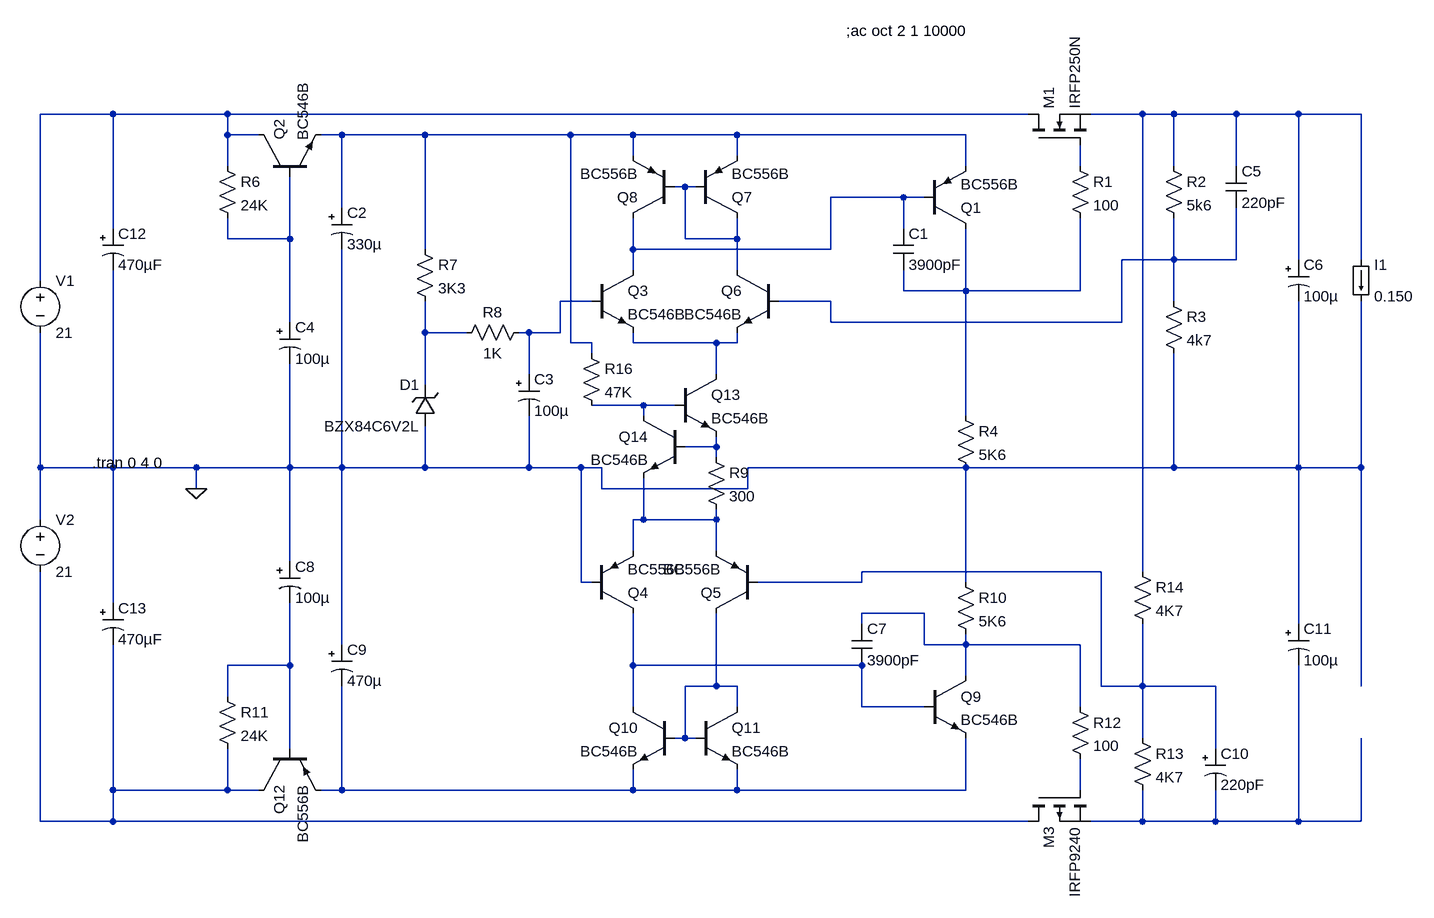
[diagram p0: schematic Draft3.asc]
Draft3.asc, the LTspice schematic file:
Version 4
SHEET 1 1752 1332
WIRE -272 112 -384 112
WIRE -96 112 -272 112
WIRE 1136 112 -96 112
WIRE 1312 112 1232 112
WIRE 1360 112 1312 112
WIRE 1456 112 1360 112
WIRE 1552 112 1456 112
WIRE 1648 112 1552 112
WIRE -96 144 -96 112
WIRE -48 144 -96 144
WIRE 80 144 48 144
WIRE 208 144 80 144
WIRE 432 144 208 144
WIRE 528 144 432 144
WIRE 688 144 528 144
WIRE 1040 144 688 144
WIRE 528 176 528 144
WIRE 688 176 688 144
WIRE -96 192 -96 144
WIRE 1040 192 1040 144
WIRE 1216 192 1216 160
WIRE 1360 192 1360 112
WIRE 1456 192 1456 112
WIRE 608 224 592 224
WIRE 624 224 608 224
WIRE 944 240 832 240
WIRE 976 240 944 240
WIRE 80 256 80 144
WIRE -272 288 -272 112
WIRE 944 288 944 240
WIRE -96 304 -96 272
WIRE 0 304 0 208
WIRE 0 304 -96 304
WIRE 608 304 608 224
WIRE 688 304 688 272
WIRE 688 304 608 304
WIRE 208 320 208 144
WIRE 528 320 528 272
WIRE 832 320 832 240
WIRE 832 320 528 320
WIRE 1360 336 1360 272
WIRE 1360 336 1280 336
WIRE 1456 336 1456 256
WIRE 1456 336 1360 336
WIRE 1552 336 1552 112
WIRE 1648 336 1648 112
WIRE 528 352 528 320
WIRE 688 352 688 304
WIRE -384 368 -384 112
WIRE 944 384 944 352
WIRE 1040 384 1040 288
WIRE 1040 384 944 384
WIRE 1216 384 1216 272
WIRE 1216 384 1040 384
WIRE 464 400 416 400
WIRE 832 400 752 400
WIRE 1360 400 1360 336
WIRE 0 432 0 304
WIRE 832 432 832 400
WIRE 1280 432 1280 336
WIRE 1280 432 832 432
WIRE 208 448 208 400
WIRE 272 448 208 448
WIRE 368 448 352 448
WIRE 416 448 416 400
WIRE 416 448 368 448
WIRE 432 464 432 144
WIRE 464 464 432 464
WIRE 528 464 528 448
WIRE 656 464 528 464
WIRE 688 464 688 448
WIRE 688 464 656 464
WIRE 464 480 464 464
WIRE 368 512 368 448
WIRE 656 512 656 464
WIRE 208 528 208 448
WIRE 544 560 464 560
WIRE 592 560 544 560
WIRE 544 576 544 560
WIRE 1040 576 1040 384
WIRE 656 624 656 608
WIRE 656 624 608 624
WIRE 656 640 656 624
WIRE -384 656 -384 448
WIRE -272 656 -272 352
WIRE -272 656 -384 656
WIRE -144 656 -272 656
WIRE 0 656 0 496
WIRE 0 656 -144 656
WIRE 80 656 80 320
WIRE 80 656 0 656
WIRE 208 656 208 592
WIRE 208 656 80 656
WIRE 368 656 368 576
WIRE 368 656 208 656
WIRE 448 656 368 656
WIRE 480 656 448 656
WIRE 1040 656 704 656
WIRE 1360 656 1360 480
WIRE 1360 656 1040 656
WIRE 1552 656 1552 400
WIRE 1552 656 1360 656
WIRE 1648 656 1648 400
WIRE 1648 656 1552 656
WIRE -144 688 -144 656
WIRE 480 688 480 656
WIRE 704 688 704 656
WIRE 704 688 480 688
WIRE -384 736 -384 656
WIRE 544 736 544 672
WIRE 544 736 528 736
WIRE 656 736 656 720
WIRE 656 736 544 736
WIRE 528 784 528 736
WIRE 656 784 656 736
WIRE 0 800 0 656
WIRE 1248 816 880 816
WIRE 1312 816 1312 112
WIRE 448 832 448 656
WIRE 464 832 448 832
WIRE 880 832 880 816
WIRE 880 832 720 832
WIRE 1040 832 1040 656
WIRE -272 864 -272 656
WIRE 976 880 880 880
WIRE 880 896 880 880
WIRE 1552 896 1552 656
WIRE 80 928 80 656
WIRE 976 928 976 880
WIRE 1040 928 1040 912
WIRE 1040 928 976 928
WIRE 1216 928 1040 928
WIRE 0 960 0 864
WIRE 0 960 -96 960
WIRE 528 960 528 880
WIRE 880 960 528 960
WIRE 1040 976 1040 928
WIRE 656 992 656 880
WIRE 656 992 608 992
WIRE 688 992 656 992
WIRE 1248 992 1248 816
WIRE 1312 992 1312 896
WIRE 1312 992 1248 992
WIRE 1424 992 1312 992
WIRE 1648 992 1648 656
WIRE -96 1008 -96 960
WIRE 528 1024 528 960
WIRE 688 1024 688 992
WIRE 880 1024 880 960
WIRE 976 1024 880 1024
WIRE 1216 1024 1216 928
WIRE 608 1072 608 992
WIRE 608 1072 592 1072
WIRE 624 1072 608 1072
WIRE 1312 1072 1312 992
WIRE 0 1088 0 960
WIRE 1424 1088 1424 992
WIRE -272 1152 -272 928
WIRE -96 1152 -96 1088
WIRE -96 1152 -272 1152
WIRE -48 1152 -96 1152
WIRE 80 1152 80 992
WIRE 80 1152 48 1152
WIRE 528 1152 528 1120
WIRE 528 1152 80 1152
WIRE 688 1152 688 1120
WIRE 688 1152 528 1152
WIRE 1040 1152 1040 1072
WIRE 1040 1152 688 1152
WIRE 1216 1152 1216 1104
WIRE -384 1200 -384 816
WIRE -272 1200 -272 1152
WIRE -272 1200 -384 1200
WIRE 1136 1200 -272 1200
WIRE 1312 1200 1312 1152
WIRE 1312 1200 1232 1200
WIRE 1424 1200 1424 1152
WIRE 1424 1200 1312 1200
WIRE 1552 1200 1552 960
WIRE 1552 1200 1424 1200
WIRE 1648 1200 1648 1072
WIRE 1648 1200 1552 1200
FLAG -144 688 0
SYMBOL polcap -16 432 R0
WINDOW 3 24 56 Left 2
SYMATTR Value 100µ
SYMATTR InstName C4
SYMATTR Description Capacitor
SYMATTR Type cap
SYMATTR SpiceLine V=6.3 Irms=2.9 Rser=0.018 Lser=0 mfg="KEMET" pn="A700D107M006ATE018" type="Al electrolytic"
SYMBOL nmos 1136 160 R270
SYMATTR InstName M1
SYMATTR Value IRFP250N
SYMBOL res 1200 176 R0
SYMATTR InstName R1
SYMATTR Value 100
SYMBOL res 1344 176 R0
SYMATTR InstName R2
SYMATTR Value 5k6
SYMBOL res 1344 384 R0
SYMATTR InstName R3
SYMATTR Value 4k7
SYMBOL pnp 976 288 M180
SYMATTR InstName Q1
SYMATTR Value BC556B
SYMBOL res 1024 560 R0
SYMATTR InstName R4
SYMATTR Value 5K6
SYMBOL npn -48 208 R270
SYMATTR InstName Q2
SYMATTR Value BC546B
SYMBOL res -112 176 R0
SYMATTR InstName R6
SYMATTR Value 24K
SYMBOL polcap 64 256 R0
WINDOW 3 24 56 Left 2
SYMATTR Value 330µ
SYMATTR InstName C2
SYMATTR Description Capacitor
SYMATTR Type cap
SYMATTR SpiceLine V=6.3 Irms=2.9 Rser=0.018 Lser=0
SYMBOL res 192 304 R0
SYMATTR InstName R7
SYMATTR Value 3K3
SYMBOL res 368 432 R90
WINDOW 0 0 56 VBottom 2
WINDOW 3 32 56 VTop 2
SYMATTR InstName R8
SYMATTR Value 1K
SYMBOL polcap 352 512 R0
WINDOW 3 24 56 Left 2
SYMATTR Value 100µ
SYMATTR InstName C3
SYMATTR Description Capacitor
SYMATTR Type cap
SYMATTR SpiceLine V=6.3 Irms=2.9 Rser=0.018 Lser=0 mfg="KEMET" pn="A700D107M006ATE018" type="Al electrolytic"
SYMBOL npn 464 352 R0
SYMATTR InstName Q3
SYMATTR Value BC546B
SYMBOL npn 752 352 M0
SYMATTR InstName Q6
SYMATTR Value BC546B
SYMBOL pnp 624 272 M180
SYMATTR InstName Q7
SYMATTR Value BC556B
SYMBOL pnp 592 272 R180
SYMATTR InstName Q8
SYMATTR Value BC556B
SYMBOL cap 928 288 R0
SYMATTR InstName C1
SYMATTR Value 3900pF
SYMATTR SpiceLine V=100 Irms=4.58 Rser=0.025 Lser=0
SYMBOL cap 1440 192 R0
SYMATTR InstName C5
SYMATTR Value 220pF
SYMATTR SpiceLine V=100 Irms=4.58 Rser=0.025 Lser=0
SYMBOL polcap 1536 336 R0
WINDOW 3 24 56 Left 2
SYMATTR Value 100µ
SYMATTR InstName C6
SYMATTR Description Capacitor
SYMATTR Type cap
SYMATTR SpiceLine V=6.3 Irms=2.9 Rser=0.018 Lser=0 mfg="KEMET" pn="A700D107M006ATE018" type="Al electrolytic"
SYMBOL pnp 464 880 M180
SYMATTR InstName Q4
SYMATTR Value BC556B
SYMBOL pnp 720 880 R180
SYMATTR InstName Q5
SYMATTR Value BC556B
SYMBOL res 1024 816 R0
SYMATTR InstName R10
SYMATTR Value 5K6
SYMBOL npn 976 976 R0
SYMATTR InstName Q9
SYMATTR Value BC546B
SYMBOL npn 592 1024 M0
SYMATTR InstName Q10
SYMATTR Value BC546B
SYMBOL npn 624 1024 R0
SYMATTR InstName Q11
SYMATTR Value BC546B
SYMBOL cap 864 896 R0
SYMATTR InstName C7
SYMATTR Value 3900pF
SYMATTR SpiceLine V=100 Irms=4.58 Rser=0.025 Lser=0
SYMBOL pnp -48 1088 M90
SYMATTR InstName Q12
SYMATTR Value BC556B
SYMBOL polcap -16 800 R0
WINDOW 3 24 56 Left 2
SYMATTR Value 100µ
SYMATTR InstName C8
SYMATTR Description Capacitor
SYMATTR Type cap
SYMATTR SpiceLine V=6.3 Irms=2.9 Rser=0.018 Lser=0 mfg="KEMET" pn="A700D107M006ATE018" type="Al electrolytic"
SYMBOL polcap 64 928 R0
WINDOW 3 24 56 Left 2
SYMATTR Value 470µ
SYMATTR InstName C9
SYMATTR Description Capacitor
SYMATTR Type cap
SYMATTR SpiceLine V=6.3 Irms=2.9 Rser=0.018 Lser=0
SYMBOL res -112 992 R0
SYMATTR InstName R11
SYMATTR Value 24K
SYMBOL pmos 1136 1152 M90
SYMATTR InstName M3
SYMATTR Value IRFP9240
SYMBOL res 1200 1008 R0
SYMATTR InstName R12
SYMATTR Value 100
SYMBOL res 1296 1056 R0
SYMATTR InstName R13
SYMATTR Value 4K7
SYMBOL res 1296 800 R0
SYMATTR InstName R14
SYMATTR Value 4K7
SYMBOL polcap 1408 1088 R0
WINDOW 3 24 56 Left 2
SYMATTR Value 220pF
SYMATTR InstName C10
SYMATTR SpiceLine V=10 Irms=0 Rser=1.6 Lser=0
SYMATTR Description Capacitor
SYMATTR Type cap
SYMBOL polcap 1536 896 R0
WINDOW 3 24 56 Left 2
SYMATTR Value 100µ
SYMATTR InstName C11
SYMATTR Description Capacitor
SYMATTR Type cap
SYMATTR SpiceLine V=6.3 Irms=2.9 Rser=0.018 Lser=0 mfg="KEMET" pn="A700D107M006ATE018" type="Al electrolytic"
SYMBOL zener 224 592 R180
WINDOW 0 24 64 Left 2
WINDOW 3 24 0 Left 2
SYMATTR InstName D1
SYMATTR Value BZX84C6V2L
SYMBOL polcap -288 288 R0
WINDOW 3 24 56 Left 2
SYMATTR Value 470µF
SYMATTR InstName C12
SYMATTR Description Capacitor
SYMATTR Type cap
SYMATTR SpiceLine V=10 Irms=2.07 Rser=0.028 Lser=0
SYMBOL polcap -288 864 R0
WINDOW 3 24 56 Left 2
SYMATTR Value 470µF
SYMATTR InstName C13
SYMATTR Description Capacitor
SYMATTR Type cap
SYMATTR SpiceLine V=10 Irms=2.07 Rser=0.028 Lser=0
SYMBOL voltage -384 352 R0
WINDOW 123 0 0 Left 2
WINDOW 39 0 0 Left 2
SYMATTR InstName V1
SYMATTR Value 21
SYMBOL voltage -384 720 R0
WINDOW 123 0 0 Left 2
WINDOW 39 0 0 Left 2
SYMATTR InstName V2
SYMATTR Value 21
SYMBOL npn 592 512 R0
SYMATTR InstName Q13
SYMATTR Value BC546B
SYMBOL npn 608 576 M0
SYMATTR InstName Q14
SYMATTR Value BC546B
SYMBOL res 640 624 R0
SYMATTR InstName R9
SYMATTR Value 300
SYMBOL res 448 464 R0
SYMATTR InstName R16
SYMATTR Value 47K
SYMBOL load 1632 336 R0
WINDOW 123 0 0 Left 2
WINDOW 39 0 0 Left 2
SYMATTR InstName I1
SYMATTR Value 0.150
TEXT -304 648 Left 2 !.tran 0 4 0
TEXT 856 -16 Left 2 !;ac oct 2 1 10000

The netlist it stands for:
* Draft3.asc
C4 N007 0 100µ V=6.3 Irms=2.9 Rser=0.018 Lser=0 mfg="KEMET" pn="A700D107M006ATE018" type="Al electrolytic"
M1 N001 N004 N002 N002 IRFP250N
R1 N004 N009 100
R2 N002 N008 5k6
R3 N008 0 4k7
Q1 N009 N006 N003 0 BC556B
R4 N009 0 5K6
Q2 N001 N007 N003 0 BC546B
R6 N001 N007 24K
C2 N003 0 330µ V=6.3 Irms=2.9 Rser=0.018 Lser=0
R7 N003 N011 3K3
R8 N010 N011 1K
C3 N010 0 100µ V=6.3 Irms=2.9 Rser=0.018 Lser=0 mfg="KEMET" pn="A700D107M006ATE018" type="Al electrolytic"
Q3 N006 N010 N012 0 BC546B
Q6 N005 N008 N012 0 BC546B
Q7 N005 N005 N003 0 BC556B
Q8 N006 N005 N003 0 BC556B
C1 N006 N009 3900pF V=100 Irms=4.58 Rser=0.025 Lser=0
C5 N002 N008 220pF V=100 Irms=4.58 Rser=0.025 Lser=0
C6 N002 0 100µ V=6.3 Irms=2.9 Rser=0.018 Lser=0 mfg="KEMET" pn="A700D107M006ATE018" type="Al electrolytic"
Q4 N019 0 N015 0 BC556B
Q5 N020 N016 N015 0 BC556B
R10 0 N017 5K6
Q9 N017 N019 N022 0 BC546B
Q10 N019 N020 N022 0 BC546B
Q11 N020 N020 N022 0 BC546B
C7 N017 N019 3900pF V=100 Irms=4.58 Rser=0.025 Lser=0
Q12 N021 N018 N022 0 BC556B
C8 0 N018 100µ V=6.3 Irms=2.9 Rser=0.018 Lser=0 mfg="KEMET" pn="A700D107M006ATE018" type="Al electrolytic"
C9 0 N022 470µ V=6.3 Irms=2.9 Rser=0.018 Lser=0
R11 N018 N021 24K
M3 N021 N023 N024 N024 IRFP9240
R12 N017 N023 100
R13 N016 N024 4K7
R14 N002 N016 4K7
C10 N016 N024 220pF V=10 Irms=0 Rser=1.6 Lser=0
C11 0 N024 100µ V=6.3 Irms=2.9 Rser=0.018 Lser=0 mfg="KEMET" pn="A700D107M006ATE018" type="Al electrolytic"
D1 0 N011 BZX84C6V2L
C12 N001 0 470µF V=10 Irms=2.07 Rser=0.028 Lser=0
C13 0 N021 470µF V=10 Irms=2.07 Rser=0.028 Lser=0
V1 N001 0 21
V2 0 N021 21
Q13 N012 N013 N014 0 BC546B
Q14 N013 N014 N015 0 BC546B
R9 N014 N015 300
R16 N003 N013 47K
I1 N002 0 0.150
.model D D
.lib standard.dio
.model NPN NPN
.model PNP PNP
.lib standard.bjt
.model NMOS NMOS
.model PMOS PMOS
.lib standard.mos
.tran 0 4 0
;ac oct 2 1 10000
.backanno
.end